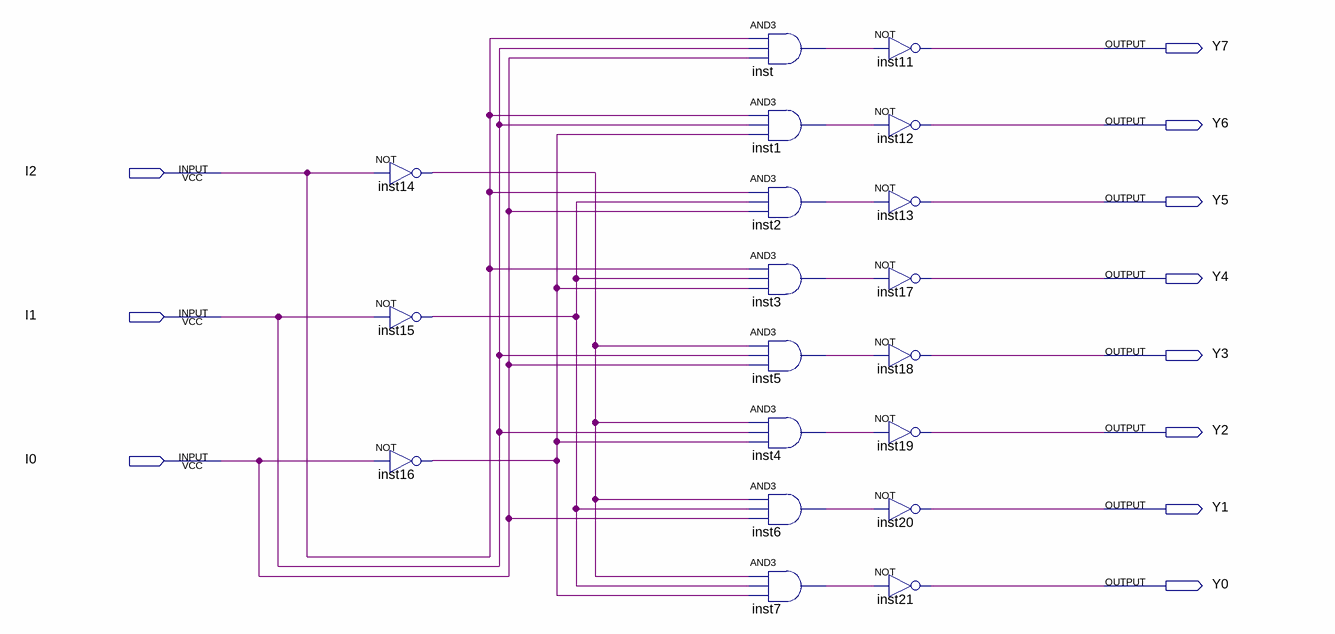
[diagram p0: schematic sheet]
// Quartus schematic decoder3_8.bdf as structural Verilog: 19 symbols, 11 pins
module decoder3_8 (
  input  I2,
  input  I1,
  input  I0,
  output Y7,
  output Y6,
  output Y5,
  output Y4,
  output Y3,
  output Y2,
  output Y1,
  output Y0
);

  wire inst1_out, inst2_out, inst3_out, inst4_out, inst5_out, inst6_out, inst7_out, inst14_out, inst15_out,
       inst16_out, inst_out;

  not inst14 (inst14_out, I2);
  not inst15 (inst15_out, I1);
  not inst16 (inst16_out, I0);
  and inst (inst_out, I2, I1, I0);
  and inst1 (inst1_out, I2, I1, inst16_out);
  and inst2 (inst2_out, I2, inst15_out, I0);
  and inst3 (inst3_out, I2, inst15_out, inst16_out);
  and inst5 (inst5_out, inst14_out, I1, I0);
  and inst4 (inst4_out, inst14_out, I1, inst16_out);
  and inst6 (inst6_out, inst14_out, inst15_out, I0);
  and inst7 (inst7_out, inst14_out, inst15_out, inst16_out);
  not inst11 (Y7, inst_out);
  not inst12 (Y6, inst1_out);
  not inst13 (Y5, inst2_out);
  not inst17 (Y4, inst3_out);
  not inst18 (Y3, inst5_out);
  not inst19 (Y2, inst4_out);
  not inst20 (Y1, inst6_out);
  not inst21 (Y0, inst7_out);
endmodule
